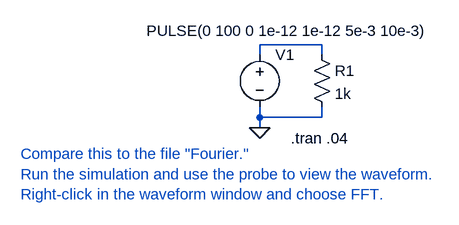
[diagram p0: schematic Fourier2.asc]
Fourier2.asc, the LTspice schematic file:
Version 4
SHEET 1 880 680
WIRE 160 176 64 176
WIRE 64 192 64 176
WIRE 160 192 160 176
WIRE 64 288 64 272
WIRE 160 288 160 272
WIRE 160 288 64 288
WIRE 64 304 64 288
FLAG 64 304 0
SYMBOL voltage 64 176 R0
WINDOW 3 -174 -21 Left 0
WINDOW 123 0 0 Left 0
WINDOW 39 0 0 Left 0
SYMATTR Value PULSE(0 100 0 1e-12 1e-12 5e-3 10e-3)
SYMATTR InstName V1
SYMBOL res 144 176 R0
SYMATTR InstName R1
SYMATTR Value 1k
TEXT 112 320 Left 0 !.tran .04
TEXT -304 344 Left 0 ;Compare this to the file "Fourier."\nRun the simulation and use the probe to view the waveform.\nRight-click in the waveform window and choose FFT.

The netlist it stands for:
* Fourier2.asc
V1 N001 0 PULSE(0 100 0 1e-12 1e-12 5e-3 10e-3)
R1 N001 0 1k
.tran .04
* Compare this to the file "Fourier."
* Run the simulation and use the probe to view the waveform.
* Right-click in the waveform window and choose FFT.
.backanno
.end